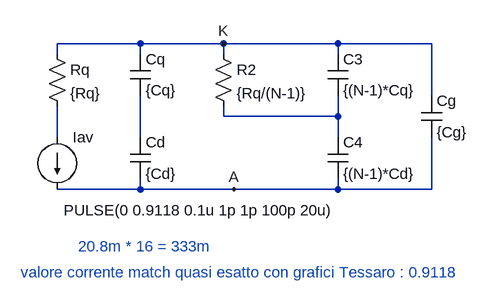
[diagram p0: schematic sipm_equivalente_controllo_corrente.asc]
sipm_equivalente_controllo_corrente.asc, the LTspice schematic file:
Version 4.1
SHEET 1 880 680
WIRE 48 112 -80 112
WIRE 176 112 48 112
WIRE 352 112 176 112
WIRE 496 112 352 112
WIRE -80 128 -80 112
WIRE 48 128 48 112
WIRE 176 128 176 112
WIRE 352 128 352 112
WIRE 496 192 496 112
WIRE 176 224 176 208
WIRE 352 224 352 192
WIRE 352 224 176 224
WIRE -80 256 -80 208
WIRE 48 256 48 192
WIRE 352 256 352 224
WIRE 48 336 48 320
WIRE 48 336 -80 336
WIRE 192 336 48 336
WIRE 352 336 352 320
WIRE 352 336 192 336
WIRE 496 336 496 256
WIRE 496 336 352 336
FLAG 176 112 K
FLAG 192 336 A
SYMBOL res -96 112 R0
SYMATTR InstName Rq
SYMATTR Value {Rq}
SYMBOL res 160 112 R0
SYMATTR InstName R2
SYMATTR Value {Rq/(N-1)}
SYMBOL current -80 256 R0
WINDOW 123 0 0 Left 0
WINDOW 39 0 0 Left 0
WINDOW 3 10 112 Left 2
SYMATTR Value PULSE(0 0.9118 0.1u 1p 1p 100p 20u)
SYMATTR InstName Iav
SYMBOL cap 32 128 R0
SYMATTR InstName Cq
SYMATTR Value {Cq}
SYMBOL cap 32 256 R0
SYMATTR InstName Cd
SYMATTR Value {Cd}
SYMBOL cap 336 128 R0
SYMATTR InstName C3
SYMATTR Value {(N-1)*Cq}
SYMBOL cap 336 256 R0
SYMATTR InstName C4
SYMATTR Value {(N-1)*Cd}
SYMBOL cap 480 192 R0
SYMATTR InstName Cg
SYMATTR Value {Cg}
TEXT -48 424 Left 2 ;20.8m * 16 = 333m
TEXT -136 464 Left 2 ;valore corrente match quasi esatto con grafici Tessaro : 0.9118

The netlist it stands for:
* sipm_equivalente_controllo_corrente.asc
Rq K N002 {Rq}
R2 K N001 {Rq/(N-1)}
Iav N002 A PULSE(0 0.9118 0.1u 1p 1p 100p 20u)
Cq K N003 {Cq}
Cd N003 A {Cd}
C3 K N001 {(N-1)*Cq}
C4 N001 A {(N-1)*Cd}
Cg K A {Cg}
* 20.8m * 16 = 333m
* valore corrente match quasi esatto con grafici Tessaro : 0.9118
.backanno
.end